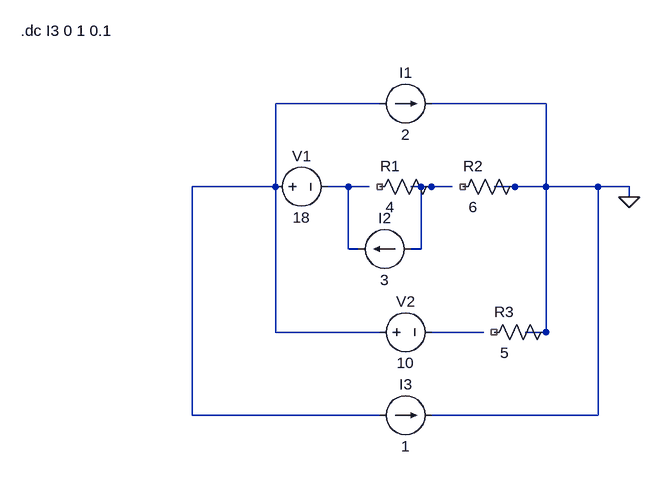
[diagram p0: schematic Ex_04_81.asc]
Ex_04_81.asc, the LTspice schematic file:
Version 4.1
SHEET 1 880 680
WIRE 160 48 0 48
WIRE 416 48 240 48
WIRE 0 176 0 48
WIRE 0 176 -128 176
WIRE 112 176 80 176
WIRE 144 176 112 176
WIRE 224 176 208 176
WIRE 272 176 224 176
WIRE 416 176 416 48
WIRE 416 176 336 176
WIRE 496 176 416 176
WIRE 544 176 496 176
WIRE 544 192 544 176
WIRE 112 272 112 176
WIRE 128 272 112 272
WIRE 224 272 224 176
WIRE 224 272 208 272
WIRE 0 400 0 176
WIRE 160 400 0 400
WIRE 320 400 240 400
WIRE 416 400 416 176
WIRE 416 400 384 400
WIRE -128 528 -128 176
WIRE 160 528 -128 528
WIRE 496 528 496 176
WIRE 496 528 240 528
FLAG 544 192 0
SYMBOL voltage -16 176 R270
WINDOW 0 32 56 VTop 2
WINDOW 3 -32 56 VBottom 2
WINDOW 123 0 0 Left 0
WINDOW 39 0 0 Left 0
SYMATTR InstName V1
SYMATTR Value 18
SYMBOL voltage 144 400 R270
WINDOW 0 32 56 VTop 2
WINDOW 3 -32 56 VBottom 2
WINDOW 123 0 0 Left 0
WINDOW 39 0 0 Left 0
SYMATTR InstName V2
SYMATTR Value 10
SYMBOL current 160 48 R270
WINDOW 0 32 40 VTop 2
WINDOW 3 -32 40 VBottom 2
WINDOW 123 0 0 Left 0
WINDOW 39 0 0 Left 0
SYMATTR InstName I1
SYMATTR Value 2
SYMBOL res 144 192 R270
WINDOW 0 32 32 VTop 2
WINDOW 3 0 32 VBottom 2
SYMATTR InstName R1
SYMATTR Value 4
SYMBOL res 272 192 R270
WINDOW 0 32 32 VTop 2
WINDOW 3 0 32 VBottom 2
SYMATTR InstName R2
SYMATTR Value 6
SYMBOL res 320 416 R270
WINDOW 0 32 32 VTop 2
WINDOW 3 0 32 VBottom 2
SYMATTR InstName R3
SYMATTR Value 5
SYMBOL current 208 272 R90
WINDOW 0 -32 40 VBottom 2
WINDOW 3 32 40 VTop 2
WINDOW 123 0 0 Left 0
WINDOW 39 0 0 Left 0
SYMATTR InstName I2
SYMATTR Value 3
SYMBOL current 160 528 R270
WINDOW 0 32 40 VTop 2
WINDOW 3 -32 40 VBottom 2
WINDOW 123 0 0 Left 0
WINDOW 39 0 0 Left 0
SYMATTR InstName I3
SYMATTR Value 1
TEXT -392 -64 Left 2 !.dc I3 0 1 0.1

The netlist it stands for:
* Ex_04_81.asc
V1 N001 N002 18
V2 N001 N004 10
I1 N001 0 2
R1 NC_01 N003 4
R2 NC_02 0 6
R3 NC_03 0 5
I2 N003 N002 3
I3 N001 0 1
.dc I3 0 1 0.1
.backanno
.end